# EAGLE design breakout (EAGLE 7.2.0)
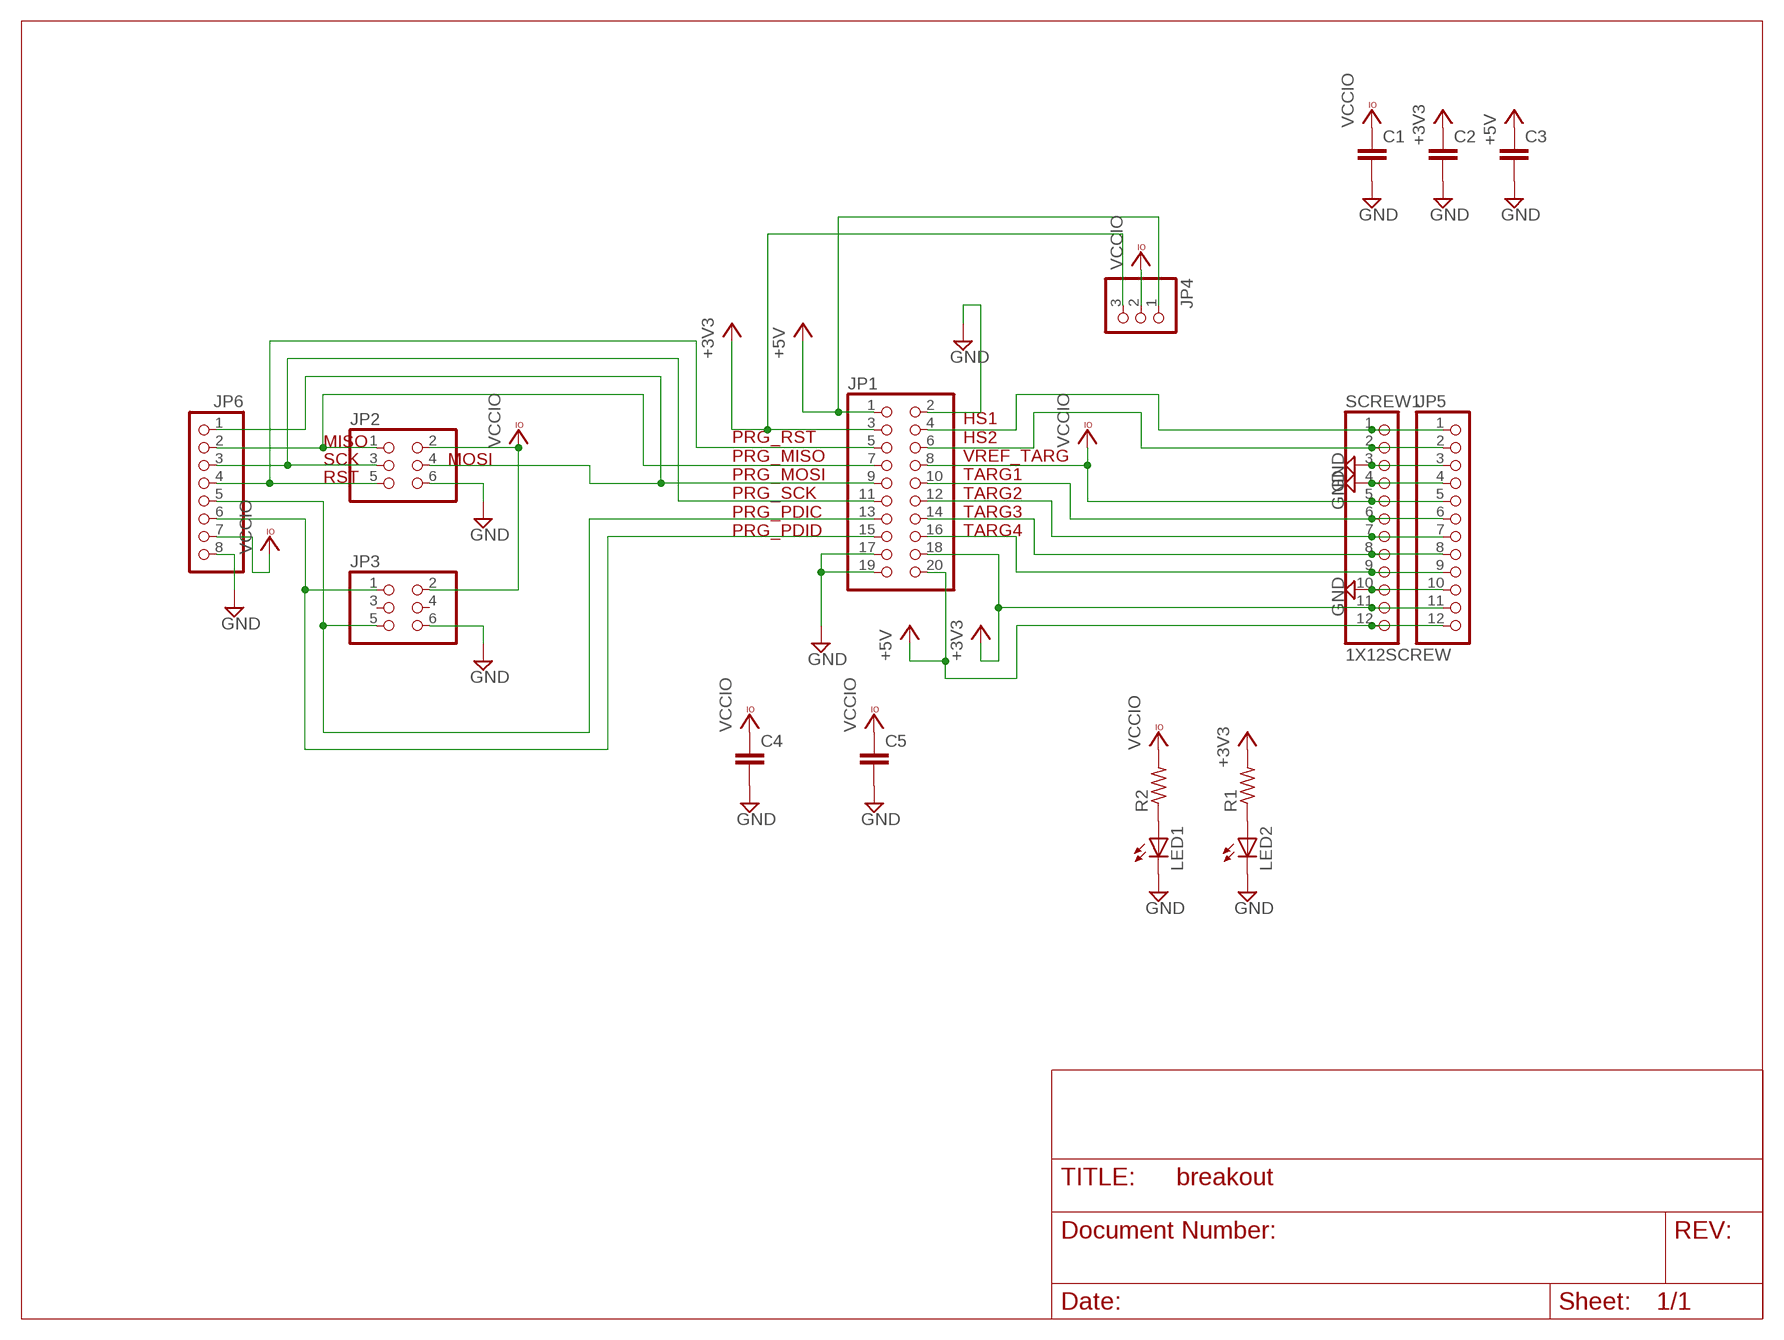
[diagram p0: schematic, sheet 1]

## Parts
C1  C-EUC0805  [C0805]
C2  C-EUC0805  [C0805]
C3  C-EUC0805  [C0805]
C4  C-EUC0805  [C0805]
C5  C-EUC0805  [C0805]
JP1  PINHD-2X10  [2X10]
JP2  PINHD-2X3  [2X03]
JP3  PINHD-2X3  [2X03]
JP4  PINHD-1X3  [1X03]
JP5  PINHD-1X12  [1X12]
JP6  PINHD-1X8  [1X08]
LED1  LED3MM  [LED3MM]
LED2  LED3MM  [LED3MM]
R1  R-US_R0805  [R0805]
R2  R-US_R0805  [R0805]
SCREW1  1X12SCREW  [1X12_SCREW]

## Nets
+3V3: C2.1 JP1.3 JP1.18 JP4.3 JP5.11 R1.2 SCREW1.11
+5V: C3.1 JP1.1 JP1.20 JP4.1 JP5.12 SCREW1.12
GND: C1.2 C2.2 C3.2 C4.2 C5.2 JP1.2 JP1.17 JP1.19 JP2.6 JP3.6 JP5.3 JP5.4 JP5.10 JP6.8 LED1.K(C) LED2.K(C) SCREW1.3 SCREW1.4 SCREW1.10
MISO: JP1.7 JP2.1 JP6.2
MOSI: JP1.9 JP2.4 JP6.1
N$1: LED2.A R1.1
N$2: LED1.A R2.1
N$5: JP1.4 JP5.1 SCREW1.1
N$6: JP1.15 JP3.1 JP6.6
N$7: JP1.13 JP3.5 JP6.5
N$8: JP1.6 JP5.2 SCREW1.2
N$12: JP1.10 JP5.6 SCREW1.6
N$13: JP1.12 JP5.7 SCREW1.7
N$14: JP1.14 JP5.8 SCREW1.8
N$15: JP1.16 JP5.9 SCREW1.9
RST: JP1.5 JP2.5 JP6.4
SCK: JP1.11 JP2.3 JP6.3
VCCIO: C1.1 C4.1 C5.1 JP1.8 JP2.2 JP3.2 JP4.2 JP5.5 JP6.7 R2.2 SCREW1.5
Unconnected: JP3.3 JP3.4

## Notes on the sheet
- MISO
- SCK | MOSI
- RST
- PRG_RST
  PRG_MISO
  PRG_MOSI
  PRG_SCK
  PRG_PDIC
  PRG_PDID
- HS1
  HS2
  VREF_TARG
  TARG1
  TARG2
  TARG3
  TARG4

## Library data of the parts
C1-C5 = resistor:C-EU: CAPACITOR, European symbol
JP1 = pinhead:PINHD-2X10: PIN HEADER
JP2 JP3 = SparkFun:PINHD-2X3: PIN HEADER
JP4 = adafruit:PINHD-1X3: PIN HEADER
JP5 = pinhead:PINHD-1X12: PIN HEADER
JP6 = pinhead:PINHD-1X8: PIN HEADER
LED1 LED2 = adafruit:LED: LED OSRAM: - CHIPLED LG R971, LG N971, LY N971, LG Q971, LY Q971, LO R971, LY R971 LH N974, LH R974 LS Q976, LO Q976, LY Q976 LO Q996 - Hyper CHIPLED LW Q18S LB Q993, LB Q99A, LB R99A - SideLED LS A670, LO A670, LY A670, LG A670, LP A670 LB A673, LV A673, LT A673, LW A673 LH A674 LY A675 LS A676, LA A676, LO A676, LY A676, LW A676 LS A679, LY A679, LG A679 - Hyper Micro SIDELED® LS Y876, LA Y876, LO Y876, LY Y876 LT Y87S - SmartLED LW L88C, LW L88S LB L89C, LB L89S, LG L890 LS L89K, LO L89K, LY L89K LS L896, LA L896, LO L896, LY L896 - TOPLED LS T670, LO T670, LY T670, LG T670, LP T670 LSG T670, LSP T670, LSY T670, LOP T670, LYG T670 LG T671, LOG T671, LSG T671 LB T673, LV T673, LT T673, LW T673 LH T674 LS T676, LA T676, LO T676, LY T676, LB T676, LH T676, LSB T676, LW T676 LB T67C, LV T67C, LT T67C, LS T67K, LO T67K, LY T67K, LW E67C LS E67B, LA E67B, LO E67B, LY E67B, LB E67C, LV E67C, LT E67C LW T67C LS T679, LY T679, LG T679 LS T770, LO T770, LY T770, LG T770, LP T770 LB T773, LV T773, LT T773, LW T773 LH T774 LS E675, LA E675, LY E675, LS T675 LS T776, LA T776, LO T776, LY T776, LB T776 LHGB T686 LT T68C, LB T68C - Hyper Mini TOPLED® LB M676 - Mini TOPLED Santana® LG M470 LS M47K, LO M47K, LY M47K Source: http://www.osram.convergy.de/
R1 R2 = resistor:R-US_: RESISTOR, American symbol
SCREW1 = customs:1X12SCREW

## Board
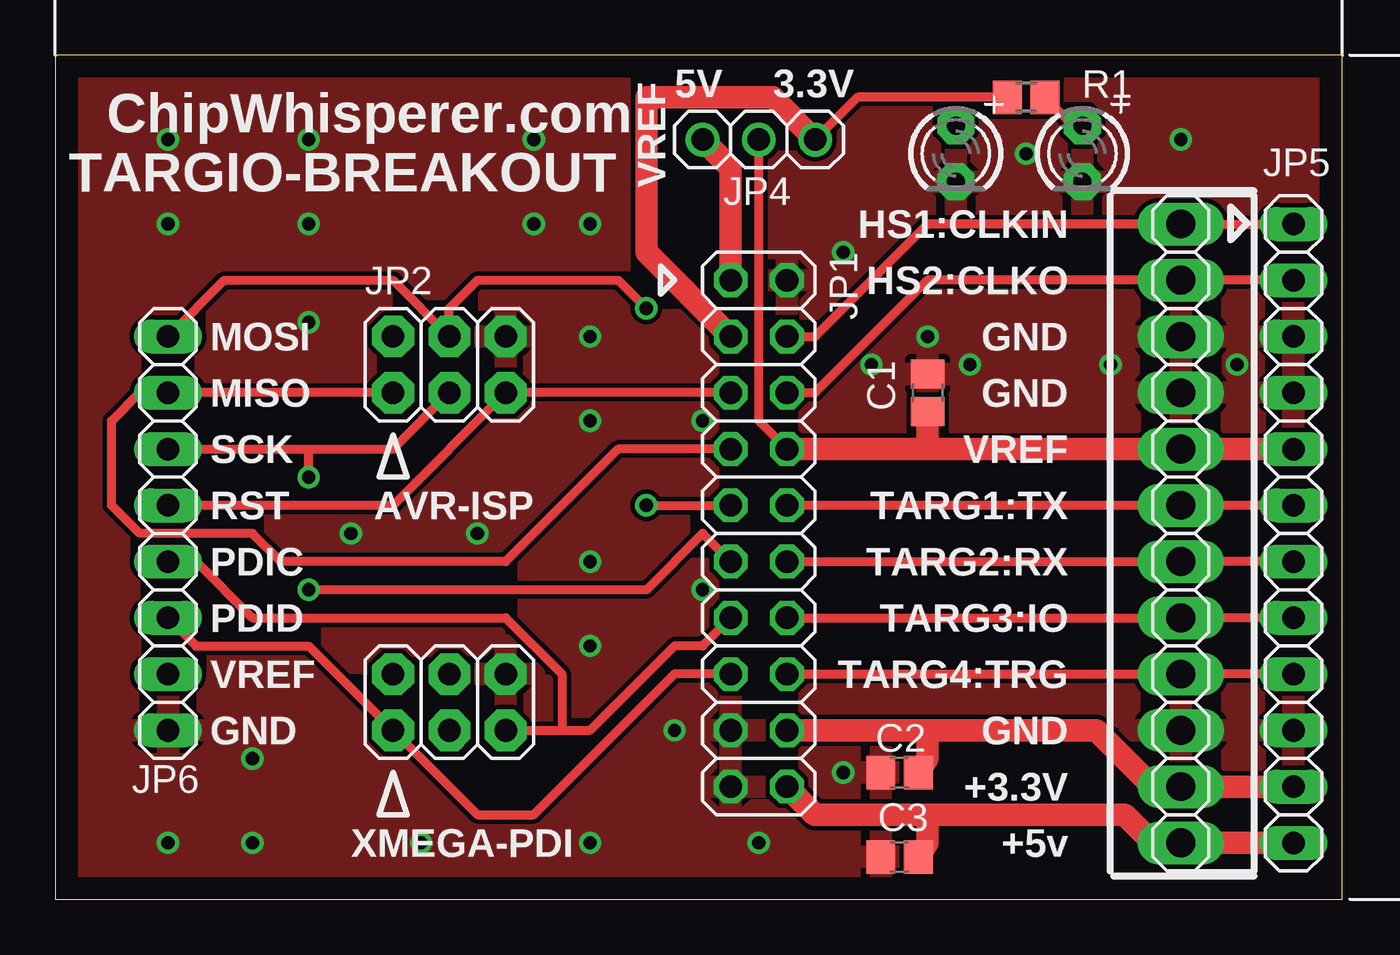
[diagram p1: board, top side]
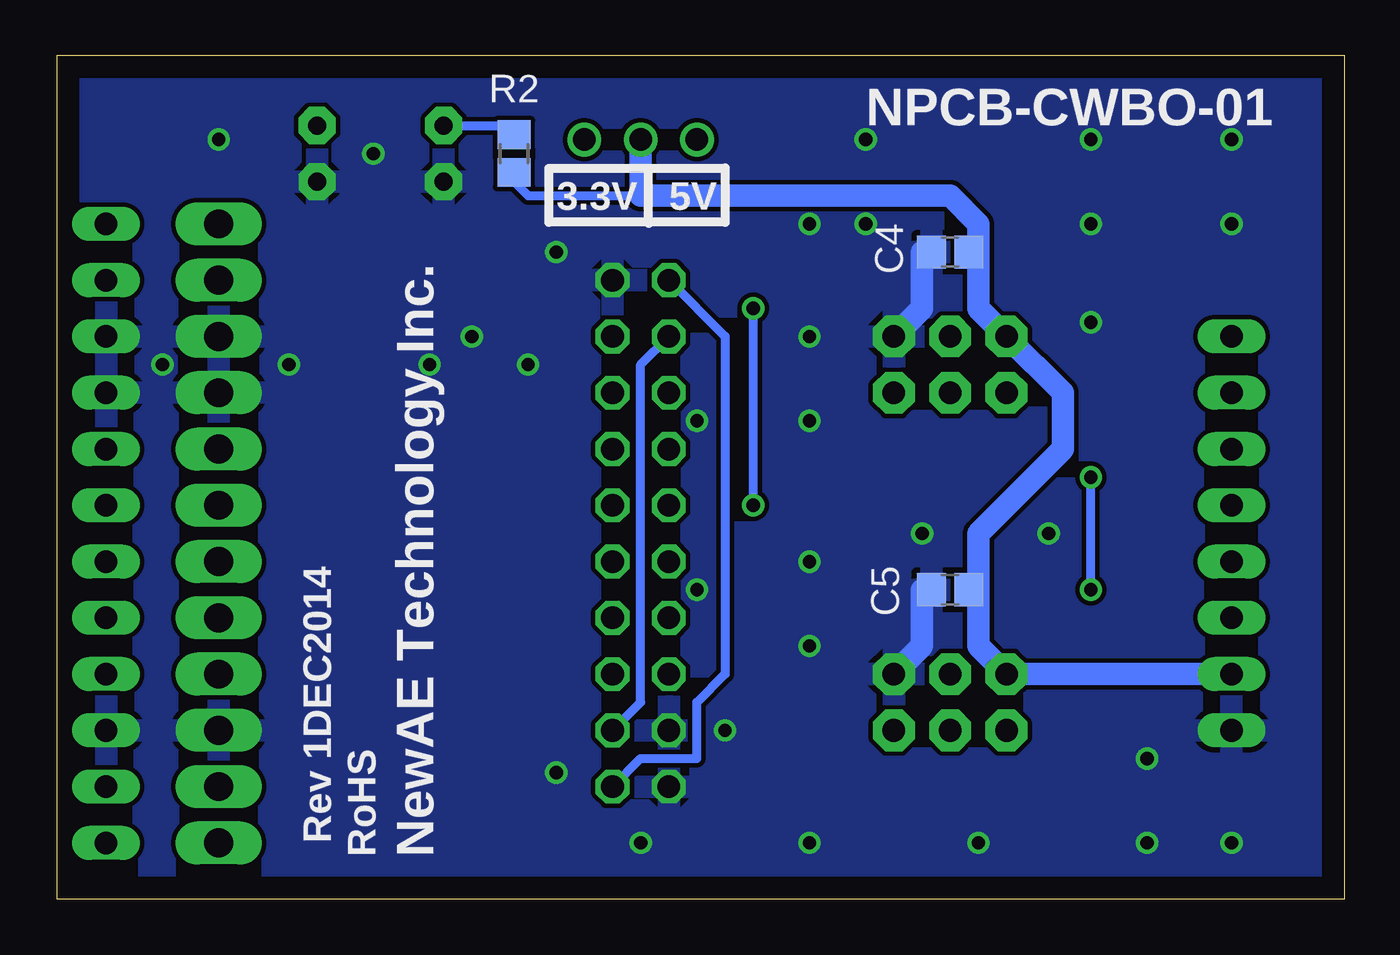
[diagram p2: board, bottom side, seen from below]

Size 58.09 x 38.09 mm. Coordinates in mm from the lower left corner, seen from the top.
Outline: 0,0 58.09,0 58.09,38.09 0,38.09 0,0
Copper layers (1*16): Top 0.035mm / dielectric 1.5mm / Bottom 0.035mm
Design rules "default *": minimum track width 10mil, minimum drill 24mil, track to track 8mil, track to pad 8mil, pad to pad 8mil, via to via 8mil, smd to smd 8mil, copper to edge 40mil, drill to drill 8mil, minimum pad ring 10mil, minimum via ring 8mil, stop-mask expansion 4mil, vias tented up to drill 25mil, thermal gap 10mil

### Footprints (pad centres in the part's own frame; a part is rotated, then mirrored left to right if it is on the bottom)
C0805 = smd 1.3 x 1.5: 1 -0.85,0; 2 0.85,0
2X10 = drill 1.016 octagon: 1 -11.43,-1.27; 2 -11.43,1.27; 3 -8.89,-1.27; 4 -8.89,1.27; 5 -6.35,-1.27; 6 -6.35,1.27; 7 -3.81,-1.27; 8 -3.81,1.27; 9 -1.27,-1.27; 10 -1.27,1.27; 11 1.27,-1.27; 12 1.27,1.27; 13 3.81,-1.27; 14 3.81,1.27; 15 6.35,-1.27; 16 6.35,1.27; 17 8.89,-1.27; 18 8.89,1.27; 19 11.43,-1.27; 20 11.43,1.27
2X03 = drill 1.016 pad 1.88 octagon: 1 -2.54,-1.27; 2 -2.54,1.27; 3 0,-1.27; 4 0,1.27; 5 2.54,-1.27; 6 2.54,1.27
1X03 = drill 1.016: 1 -2.54,0; 2 0,0; 3 2.54,0
1X12 = drill 1.016 long: 1 -13.97,0; 2 -11.43,0; 3 -8.89,0; 4 -6.35,0; 5 -3.81,0; 6 -1.27,0; 7 1.27,0; 8 3.81,0; 9 6.35,0; 10 8.89,0; 11 11.43,0; 12 13.97,0
1X08 = drill 1.016 long: 1 -8.89,0; 2 -6.35,0; 3 -3.81,0; 4 -1.27,0; 5 1.27,0; 6 3.81,0; 7 6.35,0; 8 8.89,0
LED3MM = drill 0.813 pad 1.676 octagon: A -1.27,0; K 1.27,0
R0805 = smd 1.3 x 1.5: 1 -0.85,0; 2 0.85,0
1X12_SCREW = drill 1.3 long: 1 -13.97,0; 2 -11.43,0; 3 -8.89,0; 4 -6.35,0; 5 -3.81,0; 6 -1.27,0; 7 1.27,0; 8 3.81,0; 9 6.35,0; 10 8.89,0; 11 11.43,0; 12 13.97,0

### Placement (x,y rotation side)
C1  39.37,22.86 90 top
C2  38.1,5.71 180 top
C3  38.1,1.91 180 top
C4  17.78,29.21 180 bottom
C5  17.78,13.97 180 bottom
JP1  31.75,16.51 270 top
JP2  17.78,24.13 0 top
JP3  17.78,8.89 0 top
JP4  31.75,34.29 0 top
JP5  55.88,16.51 270 top
JP6  5.08,16.51 270 top
LED1  40.64,33.66 270 top
LED2  46.36,33.66 270 top
R1  43.81,36.2 180 top
R2  37.47,33.66 270 bottom
SCREW1  50.8,16.51 270 top

### Tracks (layer width: path | path; a pad name or v marks a point on that pad's centre or on a via)
+3V3
  Top 0.406: R1.2 36.2,36.2 JP4.3
  Top 1.016: JP4.3 32.39,36.2 26.67,36.2 26.67,29.21 JP1.3 | JP5.11 SCREW1.11 49.53,5.08 46.99,7.62 39.37,7.62 | JP1.18 39.37,7.62 | 39.37,7.62 39.37,6.35 C2.1
  Bottom 0.406: JP1.3 31.75,24.13 31.75,8.89 JP1.18
+5V
  Top 1.016: JP4.1 30.48,33.02 JP1.1 | JP5.12 SCREW1.12 49.53,2.54 48.26,3.81 39.37,3.81 | JP1.20 34.29,3.81 39.37,3.81 | 39.37,3.81 39.37,2.54 C3.1
  Bottom 0.406: JP1.20 31.75,6.35 29.21,6.35 29.21,8.89 27.94,10.16 27.94,25.4 JP1.1
GND  (via drill 0.6)
  Bottom 1.016: C4.2 19.05,29.21 19.05,26.67 JP2.6 | C5.2 19.05,13.97 19.05,11.43 JP3.6
  other vias: 5.08,34.29 11.43,34.29 11.43,30.48 5.08,30.48 21.59,30.48 24.13,30.48 21.59,34.29 35.56,29.21 43.81,33.66 50.8,34.29 39.37,25.4 41.28,24.13 36.83,24.13 31.75,2.54 24.13,2.54 16.51,2.54 8.89,2.54 5.08,2.54 8.89,6.35 24.13,11.43 35.56,5.71 53.34,24.13 47.62,24.13 27.94,7.62 29.21,21.59 29.21,13.97 24.13,15.24 24.13,21.59 24.13,25.4 13.34,16.51 19.05,16.51 11.43,26.03
  pour Bottom: 0,38.1 58.42,38.1 58.42,0 0,0
  pour Top: 0,38.1 58.42,38.1 58.42,0 0,0
MISO
  Top 0.406: JP2.1 JP6.2 3.81,22.86 2.54,21.59 2.54,17.78 3.81,16.51 8.89,16.51 10.16,15.24 20.32,15.24 25.4,20.32 JP1.7
MOSI  (via drill 0.6)
  Top 0.406: JP6.1 7.62,27.94 15.24,27.94 JP2.4 17.78,26.67 19.05,27.94 25.4,27.94 v26.67,26.67 | v26.67,17.78 JP1.9
  Bottom 0.406: v26.67,26.67 v26.67,17.78
N$1
  Top 0.406: LED2.A 45.94,34.93 R1.1
N$2
  Bottom 0.406: LED1.A 37.89,34.93 R2.1
N$5
  Top 0.406: JP1.4 34.29,25.4 39.37,30.48 SCREW1.1 JP5.1
N$6
  Top 0.406: JP1.15 27.94,10.16 21.59,3.81 19.05,3.81 JP3.1 11.43,11.43 6.35,11.43 JP6.6
N$7
  Top 0.406: JP1.13 29.21,11.43 27.94,11.43 24.13,7.62 22.86,7.62 | JP3.5 22.86,7.62 | 22.86,7.62 22.86,10.16 20.32,12.7 8.89,12.7 6.35,15.24 JP6.5
N$8
  Top 0.406: JP1.6 34.29,22.86 39.37,27.94 SCREW1.2 JP5.2
N$12
  Top 0.406: JP1.10 SCREW1.6 JP5.6
N$13
  Top 0.406: JP1.12 SCREW1.7 JP5.7
N$14
  Top 0.406: JP1.14 SCREW1.8 JP5.8
N$15
  Top 0.406: JP1.16 SCREW1.9 JP5.9
RST
  Top 0.406: JP1.5 JP2.5 15.24,17.78 JP6.4
SCK  (via drill 0.6)
  Top 0.406: JP6.3 11.43,20.32 | 11.43,20.32 15.24,20.32 JP2.3 | JP1.11 29.21,16.51 26.67,13.97 v11.43,13.97 | v11.43,19.05 11.43,20.32
  Bottom 0.406: v11.43,13.97 v11.43,19.05
VCCIO
  Top 0.406: JP4.2 31.75,21.59 JP1.8
  Top 1.016: JP1.8 39.37,20.32 | 39.37,20.32 SCREW1.5 JP5.5 | C1.1 39.37,20.32
  Bottom 0.406: R2.2 37.47,32.39 36.83,31.75 31.75,31.75
  Bottom 1.016: 16.51,29.21 16.51,26.67 JP2.2 12.7,22.86 12.7,20.32 16.51,16.51 16.51,13.97 | 16.51,13.97 16.51,11.43 JP3.2 JP6.7 | 16.51,13.97 C5.1 | 16.51,29.21 16.51,30.48 17.78,31.75 31.75,31.75 JP4.2 | 16.51,29.21 C4.1

### Text on the board
tPlace: 5V | 3.3V | ChipWhisperer.com | TARGIO-BREAKOUT | VREF | HS1:CLKIN | HS2:CLKO | MOSI | GND | MISO | GND | SCK | VREF | RST | AVR-ISP | TARG1:TX | PDIC | TARG2:RX | PDID | TARG3:IO | VREF | TARG4:TRG | GND | GND | +3.3V | XMEGA-PDI | +5v
bPlace: NPCB-CWBO-01 | 5V | 3.3V | Rev 1DEC2014 | NewAE Technology Inc. | RoHS